# EAGLE design H-bridge (EAGLE 7.1.0)
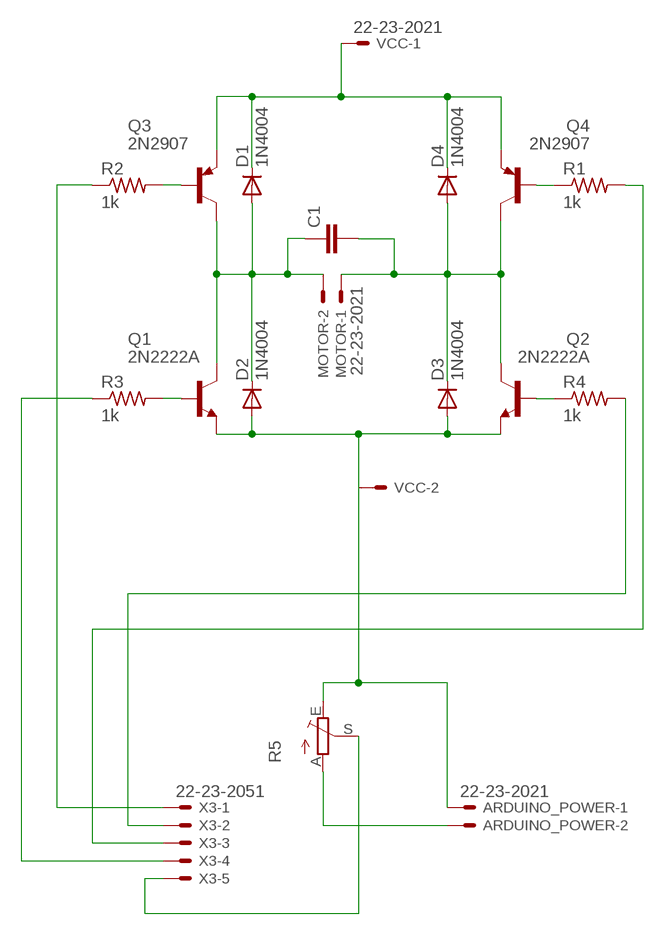
[diagram p0: schematic, sheet 1]

## Parts
ARDUINO_POWER  22-23-2021  [22-23-2021]
C1  C2.5/2  [C2.5-2]
D1  1N4004  [DO41-10]
D2  1N4004  [DO41-10]
D3  1N4004  [DO41-10]
D4  1N4004  [DO41-10]
MOTOR  22-23-2021  [22-23-2021]
Q1  2N2222A  [TO18]
Q2  2N2222A  [TO18]
Q3  2N2907  [TO18]
Q4  2N2907  [TO18]
R1  1k  R-US_0309/12  [0309/12]
R2  1k  R-US_0309/12  [0309/12]
R3  1k  R-US_0309/12  [0309/12]
R4  1k  R-US_0309/12  [0309/12]
R5  TRIM_EU-CA6V  [CA6V]
VCC  22-23-2021  [22-23-2021]
X3  22-23-2051  [22-23-2051]

## Nets
GND: ARDUINO_POWER.1 D2.A D3.A Q1.1(E) Q2.1(E) R5.E VCC.2
N$1: Q4.2(B) R1.1
N$2: Q2.2(B) R4.1
N$3: C1.2 D3.C D4.A MOTOR.1 Q2.3(C) Q4.3(C)
N$5: R3.1 X3.4
N$7: R4.2 X3.2
N$8: C1.1 D1.A D2.C MOTOR.2 Q1.3(C) Q3.3(C)
N$9: D1.C D4.C Q3.1(E) Q4.1(E) VCC.1
N$10: Q3.2(B) R2.2
N$11: Q1.2(B) R3.2
N$12: R5.S X3.5
N$13: R2.1 X3.1
N$14: R1.2 X3.3
N$15: ARDUINO_POWER.2 R5.A

## Library data of the parts
ARDUINO_POWER MOTOR VCC = con-molex:22-23-2021: .100" (2.54mm) Center Header - 2 Pin; MF: MOLEX; MPN: 22-23-2021; OC_FARNELL: 1462926; OC_NEWARK: 25C3832
C1 = capacitor-wima:C: CAPACITOR naming: grid - package width
D1-D4 = adafruit:1N4004: DIODE General purpose 1N400x type rectifier (With bigger pads) http://www.ladyada.net/library/pcb/eaglelibrary.html
Q1 Q2 = transistor-npn:2N2222*: NPN Transistor
Q3 Q4 = transistor-pnp:2N2907*: PNP Transistor
R1-R4 = adafruit:R-US_: RESISTOR, American symbol
R5 = pot:TRIM_EU-: POTENTIOMETER
X3 = con-molex:22-23-2051: .100" (2.54mm) Center Header - 5 Pin; MF: MOLEX; MPN: 22-23-2051; OC_FARNELL: 1462952; OC_NEWARK: 38C9178

## Board
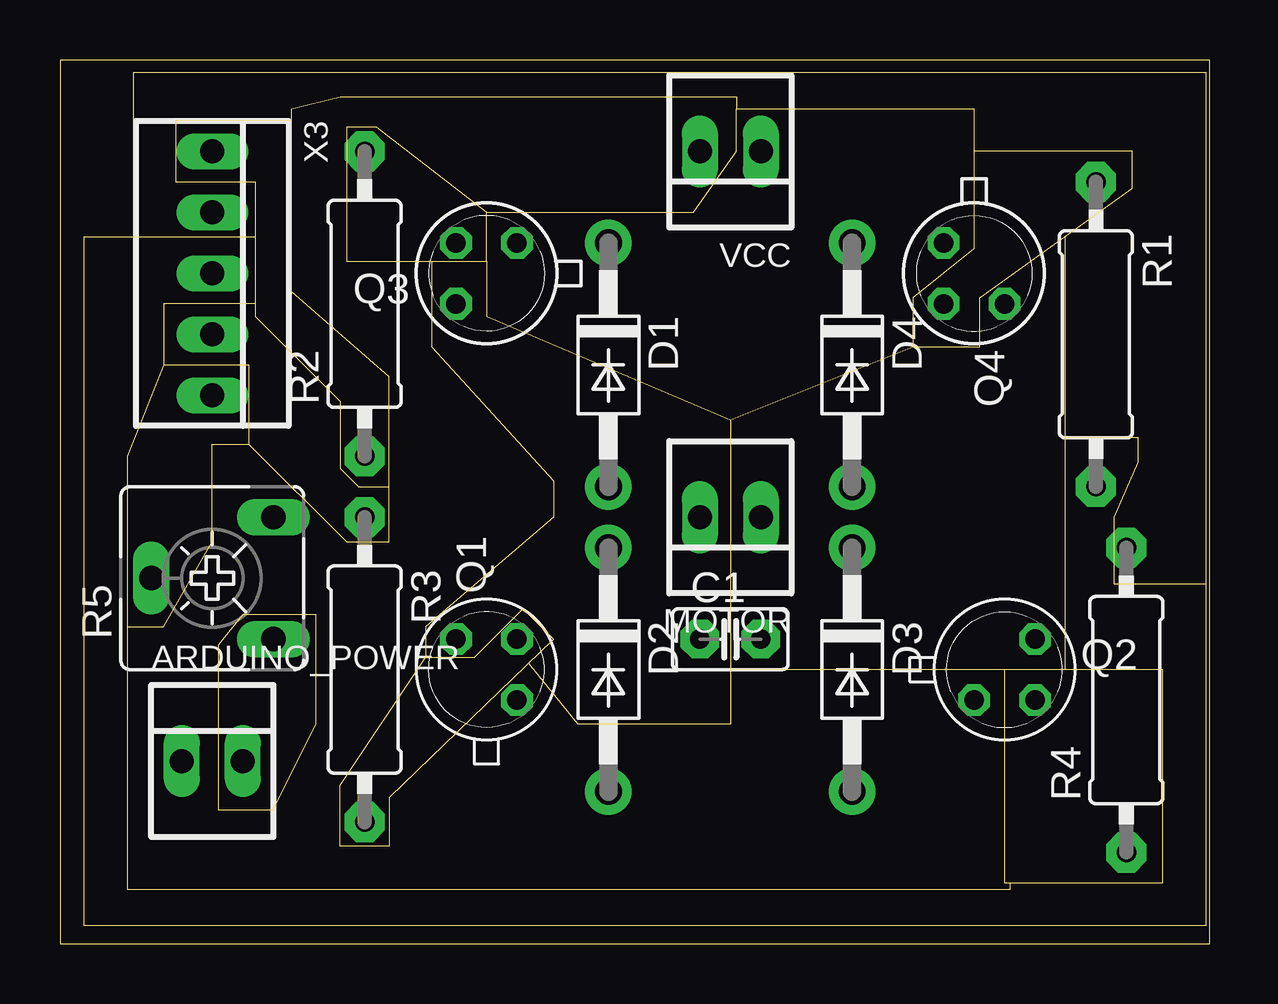
[diagram p1: board, top side]
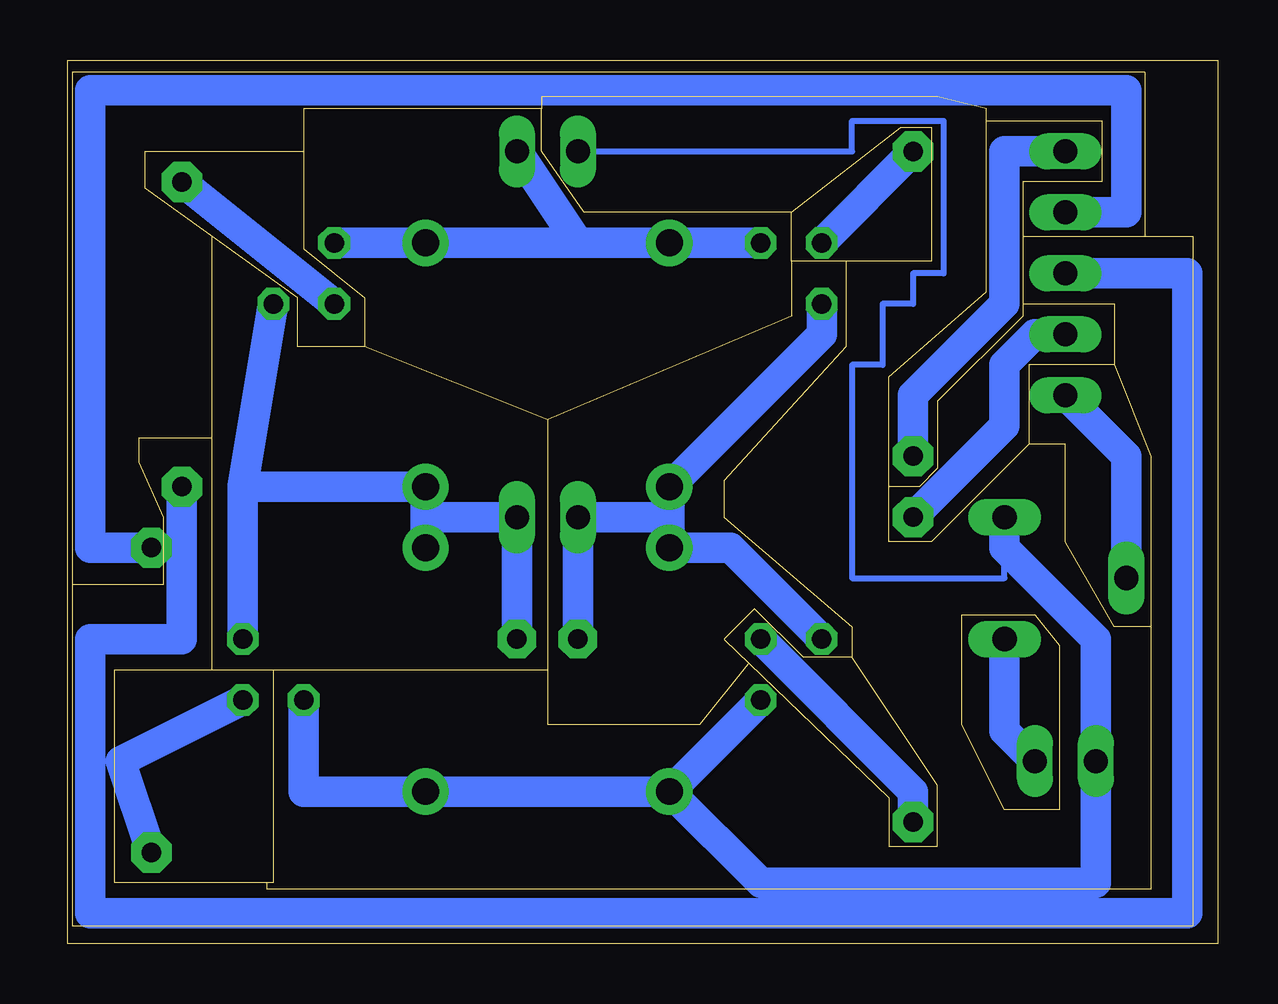
[diagram p2: board, bottom side, seen from below]

Size 47.93 x 36.82 mm. Coordinates in mm from the lower left corner, seen from the top.
Outline: 0,0 47.93,0 47.93,36.82 0,36.82 0,0
Copper layers (1*16): Top 0.035mm / dielectric 1.5mm / Bottom 0.035mm
Design rules "default": minimum track width 10mil, minimum drill 24mil, track to track 8mil, track to pad 8mil, pad to pad 8mil, via to via 8mil, smd to smd 8mil, copper to edge 40mil, drill to drill 8mil, minimum pad ring 10mil, minimum via ring 8mil, stop-mask expansion 4mil, vias tented up to drill 0mil, thermal gap 10mil
Milling: 100 lines

### Footprints (pad centres in the part's own frame; a part is rotated, then mirrored left to right if it is on the bottom)
22-23-2021 = drill 1 long: 1 -1.27,0; 2 1.27,0
C2.5-2 = drill 0.813 pad 1.6 octagon: 1 -1.27,0; 2 1.27,0
DO41-10 = drill 1.118 pad 1.93: A 5.08,0; C -5.08,0
TO18 = drill 0.813 octagon: 1 -1.27,-1.27; 2 1.27,-1.27; 3 1.27,1.27
0309/12 = drill 0.813 pad 1.676 octagon: 1 -6.35,0; 2 6.35,0
CA6V = drill 1.016 long: A -2.54,-2.54; E 2.54,-2.54; S 0,2.54
22-23-2051 = drill 1 long: 1 -5.08,0; 2 -2.54,0; 3 0,0; 4 2.54,0; 5 5.08,0

### Placement (x,y rotation side)
ARDUINO_POWER  6.35,7.62 0 top
C1  27.94,12.7 0 top
D1  22.86,24.13 270 top
D2  22.86,11.43 270 top
D3  33.02,11.43 270 top
D4  33.02,24.13 270 top
MOTOR  27.94,17.78 180 top
Q1  17.78,11.43 90 top
Q2  39.37,11.43 0 top
Q3  17.78,27.94 180 top
Q4  38.1,27.94 270 top
R1  43.18,25.4 270 top
R2  12.7,26.67 90 top
R3  12.7,11.43 270 top
R4  44.45,10.16 90 top
R5  6.35,15.24 90 top
VCC  27.94,33.02 180 top
X3  6.35,27.94 270 top

### Tracks (layer width: path | path; a pad name or v marks a point on that pad's centre or on a via)
GND
  Bottom 0.254: VCC.2 15.24,33.02 15.24,34.29 11.43,34.29 11.43,27.94 12.7,27.94 12.7,26.67 13.97,26.67 13.97,24.13 15.24,24.13 15.24,15.24 8.89,15.24 R5.E
  Bottom 1.27: Q2.1 38.1,6.35 D3.A D2.A | Q1.1 D2.A | D2.A 19.05,2.54 5.08,2.54 ARDUINO_POWER.1 5.08,12.7 8.89,16.51 R5.E
N$1
  Bottom 1.27: Q4.2 R1.1
N$2
  Bottom 1.27: Q2.2 45.72,7.62 R4.1
N$3
  Bottom 1.27: C1.2 MOTOR.1 33.02,17.78 D4.A | Q4.3 40.64,19.05 | 40.64,19.05 D4.A | Q2.3 40.64,19.05 | D3.C D4.A
N$5
  Bottom 1.27: R3.1 8.89,21.59 8.89,24.13 7.62,25.4 X3.4
N$7
  Bottom 1.27: X3.2 3.81,30.48 3.81,35.56 46.99,35.56 46.99,16.51 R4.2
N$8
  Bottom 1.27: C1.1 MOTOR.2 22.86,17.78 | Q3.3 16.51,25.4 D1.A 22.86,17.78 | 22.86,17.78 D2.C 20.32,16.51 Q1.3
N$9
  Bottom 1.27: 26.67,29.21 D1.C Q3.1 | 26.67,29.21 VCC.1 | 26.67,29.21 D4.C Q4.1
N$10
  Bottom 1.27: Q3.2 R2.2
N$11
  Bottom 1.27: Q1.2 12.7,6.35 R3.2
N$12
  Bottom 1.27: R5.S 3.81,20.32 X3.5
N$13
  Bottom 1.27: X3.1 8.89,33.02 8.89,26.67 12.7,22.86 R2.1
N$14
  Bottom 1.27: X3.3 1.27,27.94 1.27,1.27 46.99,1.27 46.99,12.7 43.18,12.7 R1.2
N$15
  Bottom 1.27: R5.A 8.89,8.89 ARDUINO_POWER.2